# EAGLE design Qwiic_TMP117 (EAGLE 9.4.2)
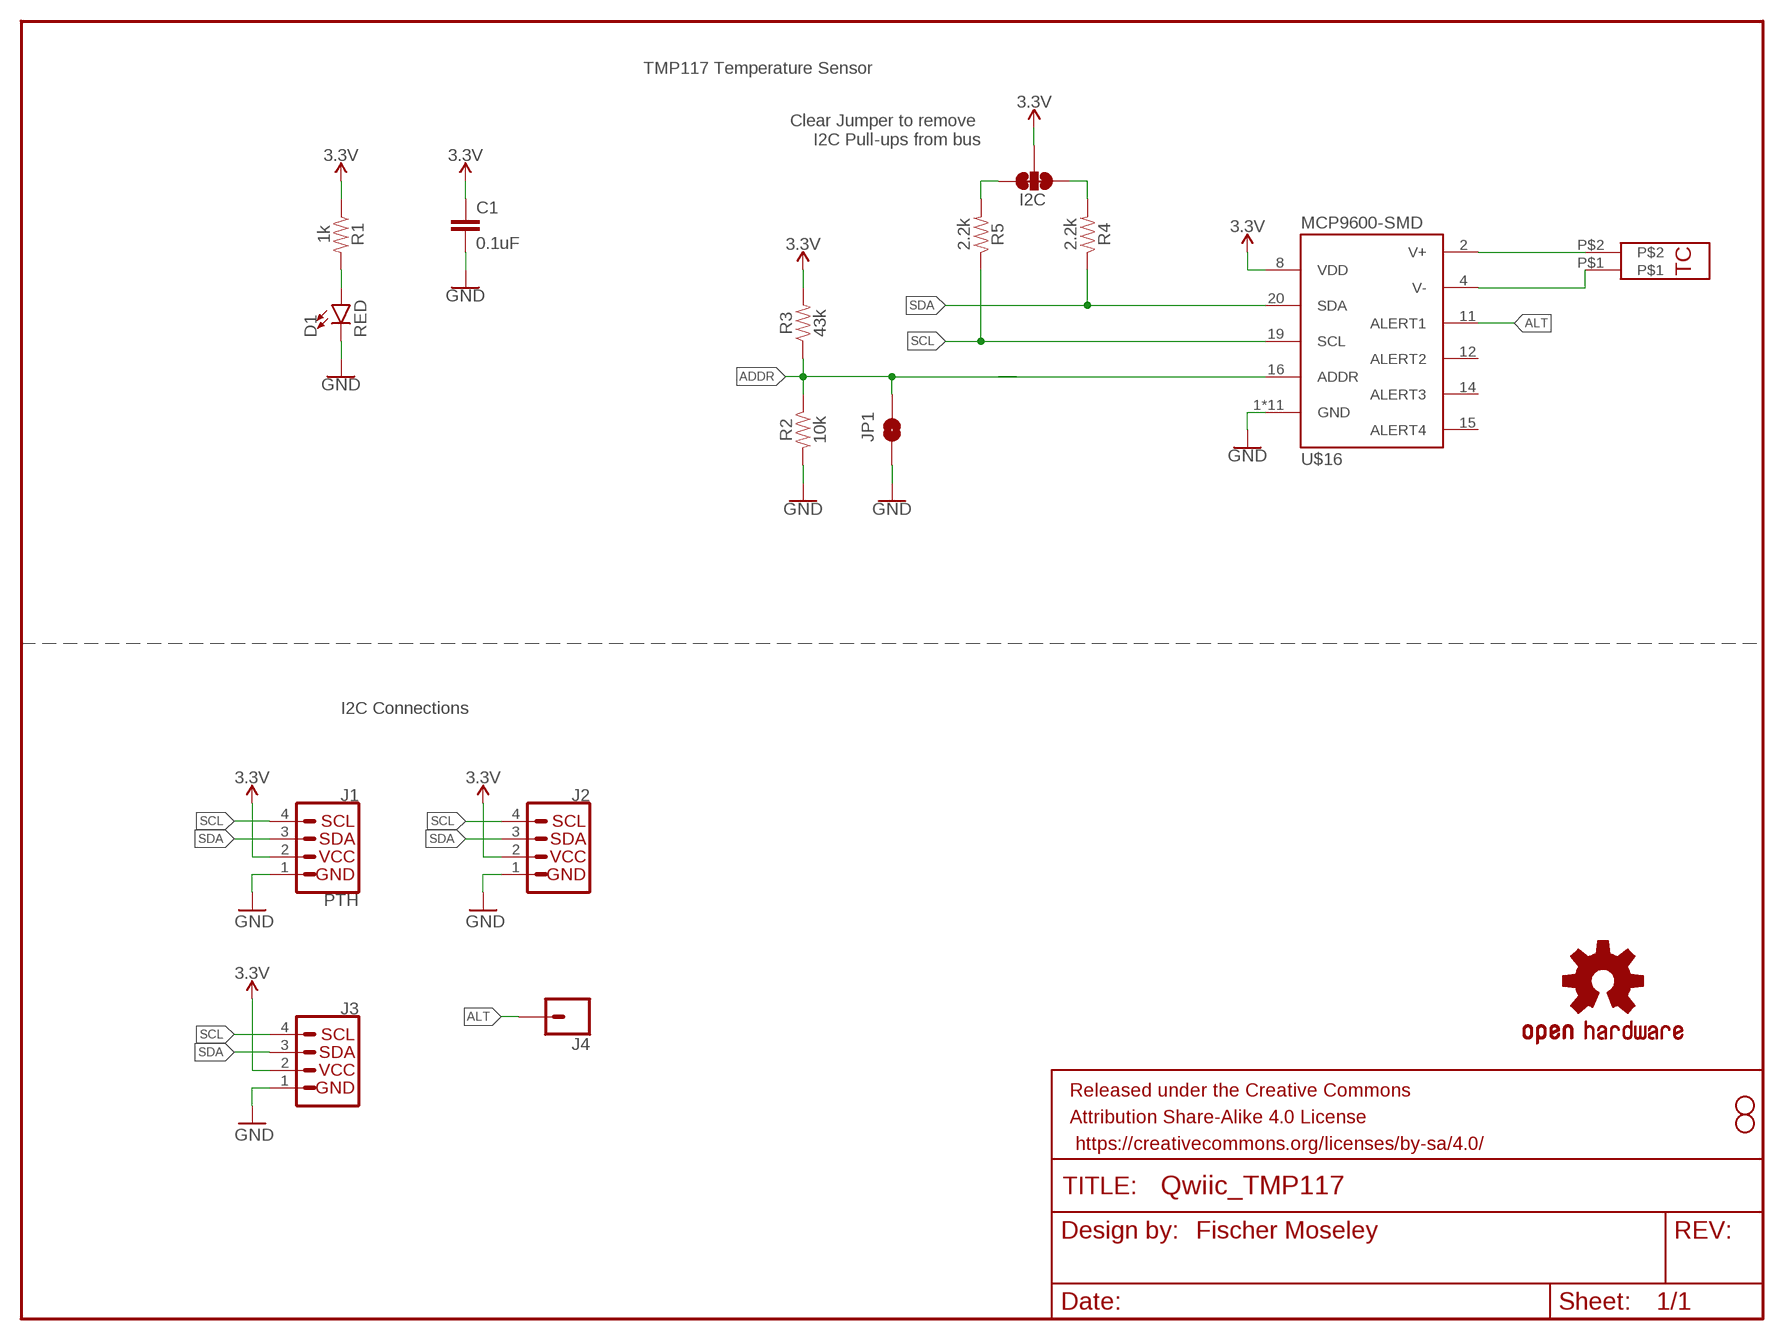
[diagram p0: schematic, sheet 1]

## Parts
C1  0.1uF  0.1UF-0603-25V-(+80/-20%)  [0603]
D1  RED  LED-RED0603  [LED-0603]
FRAME1  FRAME-LETTER  [CREATIVE_COMMONS]
I2C  JUMPER-SMT_3_2-NC_TRACE_SILK  [SMT-JUMPER_3_2-NC_TRACE_SILK]
J1  PTH  I2C_STANDARD_NO_SILK  [1X04_NO_SILK]
J2  QWIIC_CONNECTORJS-1MM  [JST04_1MM_RA]
J3  QWIIC_CONNECTORJS-1MM  [JST04_1MM_RA]
J4  CONN_01PTH_NO_SILK_YES_STOP  [1X01_NO_SILK]
JP1  JUMPER-SMT_2_NO_SILK  [SMT-JUMPER_2_NO_SILK]
JP8  STAND-OFF  [STAND-OFF]
JP9  STAND-OFF  [STAND-OFF]
LOGO1  OSHW-LOGOMINI  [OSHW-LOGO-MINI]
R1  1k  1KOHM-0603-1/10W-1%  [0603]
R2  10k  10KOHM-0603-1/10W-1%  [0603]
R3  43k  43KOHM-0603-1/10W-1%  [0603]
R4  2.2k  2.2KOHM-0603-1/10W-1%  [0603]
R5  2.2k  2.2KOHM-0603-1/10W-1%  [0603]
U$16  MCP9600-SMD  [MQFN-20]
U$24  CHARLESPAX_TC-MINI-CONNECTOR  [CHARLESPAX_TC-MINI-CONNECTOR]

## Nets
3.3V: C1.1 I2C.2 J1.2(VCC) J2.2 J3.2 R1.1 R3.2 U$16.8(VDD)
ADDR: JP1.1 R2.1 R3.1 U$16.16(ADDR)
ALT: J4.1 U$16.11(ALERT1)
GND: C1.2 D1.C J1.1(GND) J2.1 J3.1 JP1.2 R2.2 U$16.1(GND) U$16.3(GND) U$16.5(GND) U$16.6(GND) U$16.7(GND) U$16.9(GND) U$16.10(GND) U$16.13(GND) U$16.17(GND) U$16.18(GND) U$16.21(GND)
N$1: D1.A R1.2
N$2: I2C.1 R5.2
N$3: I2C.3 R4.2
N$4: U$16.2(V+) U$24.P$2
N$7: U$16.4(V-) U$24.P$1
SCL: J1.4(SCL) J2.4 J3.4 R5.1 U$16.19(SCL)
SDA: J1.3(SDA) J2.3 J3.3 R4.1 U$16.20(SDA)
Unconnected: U$16.12(ALERT2) U$16.14(ALERT3) U$16.15(ALERT4)

## Notes on the sheet
- TMP117 Temperature Sensor
- Clear Jumper to remove 
  I2C Pull-ups from bus
- I2C Connections
- Fischer Moseley

## Library data of the parts
C1 = SparkFun-Capacitors:0.1UF: 0.1µF ceramic capacitors A capacitor is a passive two-terminal electrical component used to store electrical energy temporarily in an electric field.; PROD_ID: CAP-00810
D1 = SparkFun-LED:LED-RED: Red SMD LED Used in manufacturing of most products at SparkFun Packages: 0603 - SMD 0603 package [Product Link] <http://docs.avagotech.com/docs/AV02-0551EN> 0603 SMART - SMD 0603 SMART package ( more efficient and expensive)[Product Link] <http://www.osram-os.com/Graphics/XPic2/00077099_0.pdf> 1206 - SMD1206 package [Product Link] <https://www.sparkfun.com/datasheets/DevTools/LilyPad/Q150OVS4.pdff> SparkFun Products: Pro Mini 328 -5V <https://www.sparkfun.com/products/821> RedBoard <https://www.sparkfun.com/products/12757> IOIO-OTG <https://www.sparkfun.com/products/13613>; PROD_ID: DIO-00819
FRAME1 = SparkFun-Aesthetics:FRAME-LETTER: Schematic Frame - Letter Standard 8.5x11 US Letter frame
I2C = SparkFun-Jumpers:JUMPER-SMT_3_2-NC_TRACE: Normally closed trace jumper (2 of 2 connections) This jumper has a trace between all three pads so they are normally closed (NC). Use a razor knife to open the connection(s). For best results follow the IPC guidelines for cutting traces: Cutout at least 0.063 mm (0.005 in). Remove all loose material to clean up the cut area. Seal the cut with an approved epoxy. Reapply solder to reclose the connection(s).
J1 = SparkX:I2C_STANDARD: SparkFun I2C Standard Pinout Header SparkFun has standardized on a pinout for all I2C based sensor breakouts. This pinout allows I2C boards to be plugged directly into the headers on Arduino Uno compatible boards, and to be daisy chained easily. Example SparkFun Products: SparkFun Atmospheric Sensor Breakout - BME280 <https://www.sparkfun.com/products/13676> SparkFun Altitude/Pressure Sensor Breakout - MPL3115A2 <https://www.sparkfun.com/products/11084> SparkFun TOF Range Finder Sensor - VL6180 <https://www.sparkfun.com/products/12785>
J2 J3 = SparkFun-Connectors:QWIIC_CONNECTOR: SparkFun I2C Standard Qwiic Connector An SMD 1mm pitch JST connector makes it easy and quick (get it? Qwiic?) to connect I2C devices to each other. The Qwiic system <http://www.sparkfun.com/qwiic> enables fast and solderless connection between popular platforms and various sensors and actuators. We carry 200mm <https://www.sparkfun.com/products/14204>, 100mm <https://www.sparkfun.com/products/14205>, 50mm <https://www.sparkfun.com/products/14206>, and breadboard friendly <https://www.sparkfun.com/products/14207> Qwiic cables. We also offer 10 pcs strips <https://www.sparkfun.com/products/14323> the SMD connectors.; PROD_ID: CONN-13694
J4 = SparkFun-Connectors:CONN_01: Single connection point. Often used as Generic Header-pin footprint for 0.1 inch spaced/style header connections On any of the 0.1 inch spaced packages, you can populate with these: Break Away Headers - Straight <https://www.sparkfun.com/products/116> (PRT-00116) Break Away Male Headers - Right Angle <https://www.sparkfun.com/products/553> (PRT-00553) Female Headers <https://www.sparkfun.com/products/115> (PRT-00115) Break Away Headers - Machine Pin <https://www.sparkfun.com/products/117> (PRT-00117) Break Away Female Headers - Swiss Machine Pin <https://www.sparkfun.com/products/743> (PRT-00743) This device is also useful as a general connection point to wire up your design to another part of your project. Our various solder wires solder well into these plated through hole pads. Hook-Up Wire - Assortment (Stranded, 22 AWG) <https://www.sparkfun.com/products/11375> (PRT-11375) Hook-Up Wire - Assortment (Solid Core, 22 AWG) <https://www.sparkfun.com/products/11367> (PRT-11367) View the entire wire category on our website here <https://www.sparkfun.com/categories/141> Special notes: SMTSO-256-ET is a "flush mount" nut for a 4-40 screw. We mostly use this on specialty testbeds; it is a nice way to connect hardware to your PCB at an adjustable hieght. Also note, the SNAP packages are for using a snappable style connector. We sell a baggie of snaps and they are also used on two LilyPad designs: Snap Assortment - 30 pack (male and female) <https://www.sparkfun.com/products/11347> (DEV-11347) LilyPad Arduino SimpleSnap <https://www.sparkfun.com/products/10941> (DEV-10941) LilyPad SimpleSnap Protoboard <https://www.sparkfun.com/products/10940> (DEV-10940)
JP1 = SparkFun-Jumpers:JUMPER-SMT_2_NO: Normally open jumper This jumper has two pads in close proximity to each other. Apply solder to close the connection. Round pads are easier to solder for beginners, but are a lot larger. SparkFun Product that uses the round pads: SparkFun EL Sequencer <https://www.sparkfun.com/products/12781>
JP8 JP9 = SparkFun:STAND-OFF: Stand Off This is the mechanical footprint for a #4 phillips button head screw. Use the keepout ring to avoid running the screw head into surrounding components. SKU : PRT-00447
LOGO1 = SparkFun-Aesthetics:OSHW-LOGO: Open-Source Hardware (OSHW) Logo This logo indicates the piece of hardware it is found on incorporates a OSHW license and/or adheres to the definition of open source hardware found here: http://freedomdefined.org/OSHW
R1 = SparkFun-Resistors:1KOHM: 1kΩ resistor A resistor is a passive two-terminal electrical component that implements electrical resistance as a circuit element. Resistors act to reduce current flow, and, at the same time, act to lower voltage levels within circuits. - Wikipedia; PROD_ID: RES-07856
R2 = SparkFun-Resistors:10KOHM: 10kΩ resistor A resistor is a passive two-terminal electrical component that implements electrical resistance as a circuit element. Resistors act to reduce current flow, and, at the same time, act to lower voltage levels within circuits. - Wikipedia; PROD_ID: RES-00824
R3 = SparkFun-Resistors:43KOHM: 43kΩ resistor A resistor is a passive two-terminal electrical component that implements electrical resistance as a circuit element. Resistors act to reduce current flow, and, at the same time, act to lower voltage levels within circuits. - Wikipedia; PROD_ID: RES-07858
R4 R5 = SparkFun-Resistors:2.2KOHM: 2.2kΩ resistor A resistor is a passive two-terminal electrical component that implements electrical resistance as a circuit element. Resistors act to reduce current flow, and, at the same time, act to lower voltage levels within circuits. - Wikipedia; PROD_ID: RES-08272
U$16 = MCP9600:MCP9600
U$24 = MCP9600:CHARLESPAX_TC-MINI-CONNECTOR

## Board
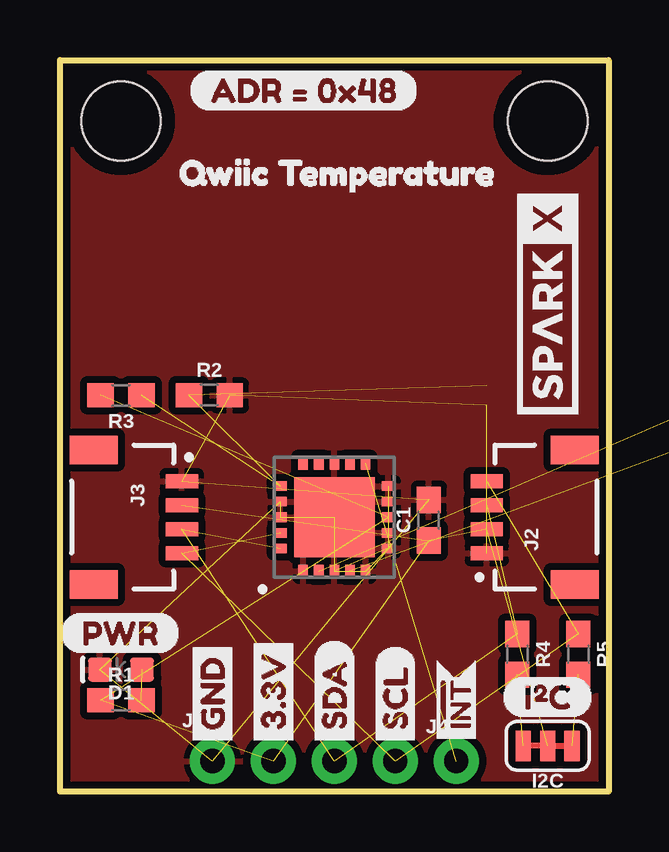
[diagram p1: board, top side]
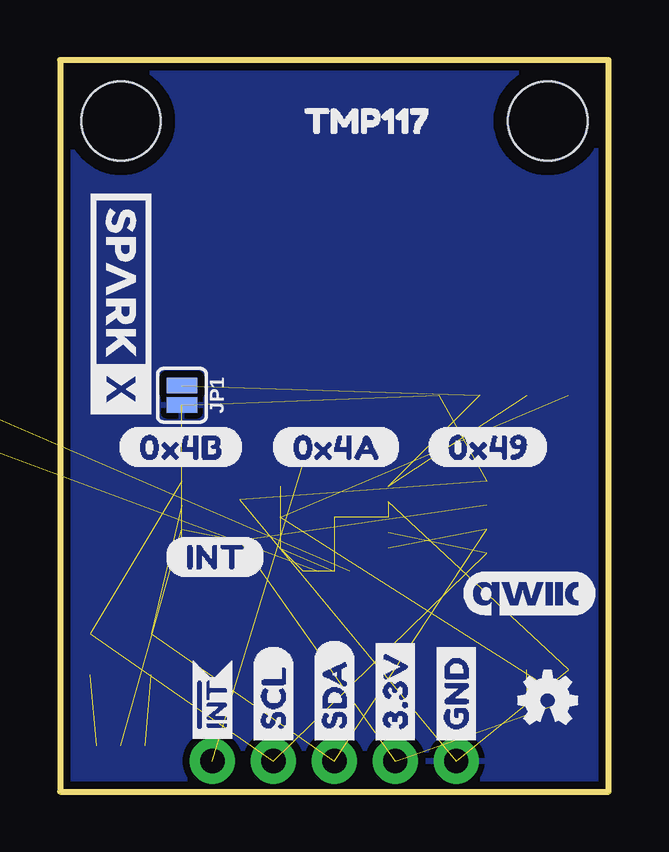
[diagram p2: board, bottom side, seen from below]

Size 22.86 x 30.48 mm. Coordinates in mm from the lower left corner, seen from the top.
Outline: 0,0 0,30.48 22.86,30.48 22.86,0 0,0
Copper layers (1*16): Top 0.035mm / dielectric 1.5mm / Bottom 0.035mm
Design rules "SparkFun-2-layer-TIGHT": minimum track width 7mil, minimum drill 15mil, track to track 7mil, track to pad 7mil, pad to pad 7mil, via to via 7mil, smd to smd 7mil, copper to edge 7mil, drill to drill 7mil, minimum pad ring 7mil, minimum via ring 7mil, stop-mask expansion 4mil, vias tented up to drill 25mil, thermal gap 10mil

### Footprints (pad centres in the part's own frame; a part is rotated, then mirrored left to right if it is on the bottom)
0603 = smd 1.1 x 1: 1 -0.85,0; 2 0.85,0
LED-0603 = smd 1 x 1: A -0.877,0; C 0.877,0
SMT-JUMPER_3_2-NC_TRACE_SILK = smd 0.635 x 1.27: 1 -1.016,0; 2 0,0; 3 1.016,0
1X04_NO_SILK = drill 1.016 pad 1.88: 1 0,0; 2 2.54,0; 3 5.08,0; 4 7.62,0
JST04_1MM_RA = smd 0.6 x 1.35: 1 -1.5,0; 2 -0.5,0; 3 0.5,0; 4 1.5,0 | smd 1.2 x 2: NC1 2.8,-3.675; NC2 -2.8,-3.675
1X01_NO_SILK = drill 1.016 pad 1.88: 1 0,0
SMT-JUMPER_2_NO_SILK = smd 0.635 x 1.27: 1 -0.406,0; 2 0.406,0
STAND-OFF = hole 3.302: 0,0
MQFN-20 = smd 0.55 x 0.4: 1 -2.25,1.3; 2 -2.25,0.65; 3 -2.25,0; 4 -2.25,-0.65; 5 -2.25,-1.3; 11 2.25,-1.3; 12 2.25,-0.65; 13 2.25,0; 14 2.25,0.65; 15 2.25,1.3 | smd 0.4 x 0.55: 6 -1.3,-2.25; 7 -0.65,-2.25; 8 0,-2.25; 9 0.65,-2.25; 10 1.3,-2.25; 16 1.3,2.25; 17 0.65,2.25; 18 0,2.25; 19 -0.65,2.25; 20 -1.3,2.25 | smd 3.35 x 3.35: 21 0,0
CHARLESPAX_TC-MINI-CONNECTOR = smd 5 x 11.6: P$1 3.25,0; P$2 -3.25,0

### Placement (x,y rotation side)
C1  15.37,11.3 90 top
D1  2.54,5.08 180 top
FRAME1  -7.62,-8.89 0 top  (outside the outline)
I2C  20.32,1.91 180 top
J1  6.35,1.27 0 top
J2  17.78,11.43 90 top
J3  5.08,11.43 270 top
J4  16.51,1.27 0 top
JP1  17.78,16.51 270 bottom
JP8  20.32,27.94 0 top
JP9  2.54,27.94 0 top
LOGO1  2.54,3.81 0 bottom
R1  2.54,3.81 0 top
R2  6.22,16.51 0 top
R3  2.54,16.51 180 top
R4  19.05,5.71 270 top
R5  21.59,5.71 270 top
U$1  [0X4B1]  20.45,14.35 0 bottom
U$2  [SPARKX-MEDIUM]  20.32,20.32 270 bottom
U$3  [INT#-[<-04]  16.51,1.52 90 top
U$4  [TMP1171]  13.59,27.94 0 bottom
U$5  [0X4A0]  14.1,14.35 0 bottom
U$6  [QWIIC_TEMPERATURE2]  4.06,25.78 0 top
U$7  [INT-()-04]  18.54,9.78 0 bottom
U$8  [0X493]  7.62,14.35 0 bottom
U$9  [SCL-[)]  13.97,1.65 90 bottom
U$10  [GND-04]  6.35,1.65 90 top
U$11  [INT#-[<-04]  16.51,1.52 90 bottom
U$12  [SCL-[)]  13.97,1.65 90 top
U$13  [SDA-[)]  11.43,1.65 90 top
U$14  [SDA-[)]  11.43,1.65 90 bottom
U$15  [QWIIC_5.5MM]  3.3,8.26 0 bottom
U$16  11.43,11.43 90 top
U$17  [SPARKX-MEDIUM]  20.32,20.32 90 top
U$18  [ADR_#_0X484]  5.33,29.21 0 top
U$19  [3.3V]  8.89,1.65 90 top
U$20  [PWR-()-04]  0,6.6 0 top
U$21  [I_SUPER2_C-()-04]  18.41,3.94 0 top
U$22  [3.3V]  8.89,1.65 90 bottom
U$23  [GND-04]  6.35,1.65 90 bottom
U$24  45.72,22.86 0 top  (outside the outline)

### Tracks (layer width: path | path; a pad name or v marks a point on that pad's centre or on a via)
3.3V  (7 unrouted)
ADDR  (3 unrouted)
ALT  (1 unrouted)
GND  (17 unrouted)
  pour Top (isolate 0.305): 0,0 0,30.48 22.86,30.48 22.86,0
  pour Top (isolate 0.305): 22.86,0 22.86,30.48 0,30.48 0,0
  pour Top (isolate 0.305): 0,0 0,30.48 22.86,30.48 22.86,0
  pour Top (isolate 0.305): 22.86,30.48 0,30.48 0,0 22.86,0
  pour Top (isolate 0.305): 0,0 22.86,0 22.86,30.48 0,30.48
  pour Top (isolate 0.305): 22.86,30.48 0,30.48 0,0 22.86,0
  pour Top (isolate 0.305): 0,0 0,30.48 22.86,30.48 22.86,0
  pour Bottom (isolate 0.305): 22.86,0 22.86,30.48 0,30.48 0,0
  pour Top (isolate 0.305): 0,0 0,30.48 22.86,30.48 22.86,0
N$1  (1 unrouted)
N$2  (1 unrouted)
N$3  (1 unrouted)
N$4  (1 unrouted)
N$7  (1 unrouted)
SCL  (4 unrouted)
SDA  (4 unrouted)

### Text on the board
tDocu: Fischer Moseley